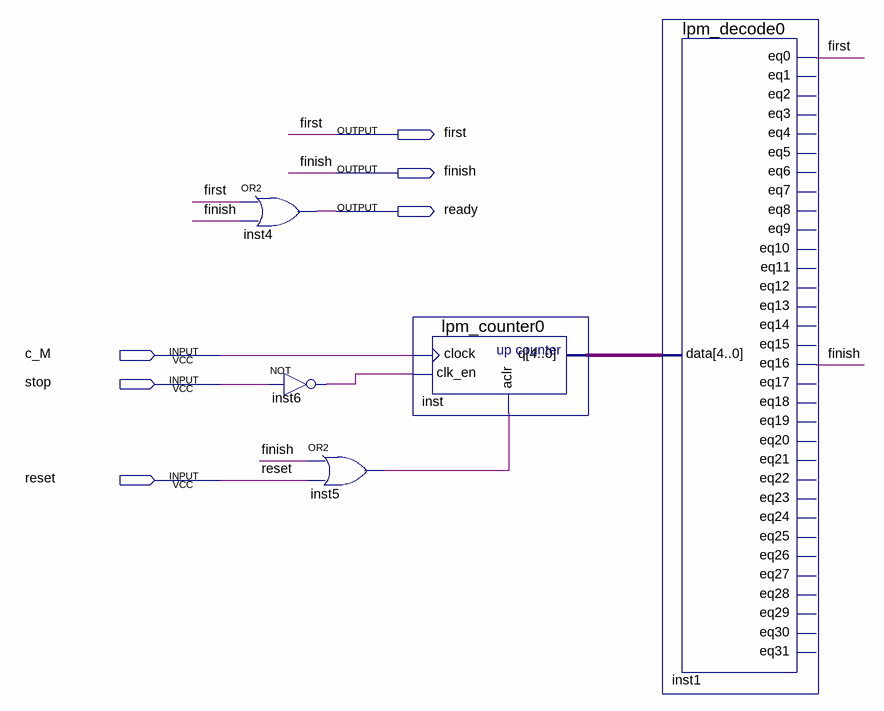
[diagram p0: schematic sheet]
// Quartus schematic ready_signal.bdf as structural Verilog: 5 symbols, 6 pins
module ready_signal (
  input  c_M,
  input  stop,
  input  reset,
  output first,
  output finish,
  output ready
);

  wire inst5_out, inst6_out;
  wire [4:0] inst_q;

  or inst4 (ready, first, finish);
  not inst6 (inst6_out, stop);
  or inst5 (inst5_out, finish, reset);
  lpm_counter0 inst (.clock(c_M), .clk_en(inst6_out), .aclr(inst5_out), .q(inst_q));
  lpm_decode0 inst1 (
    .data(inst_q), .eq0(first), .eq16(finish));  // open: eq1, eq2, eq3, eq4, eq5, eq6, eq7, eq8, eq9, eq10, eq11, eq12, eq13, eq14, eq15, eq17, eq18, eq19, eq20, eq21, eq22, eq23, eq24, eq25, eq26, eq27, eq28, eq29, eq30, eq31
endmodule
